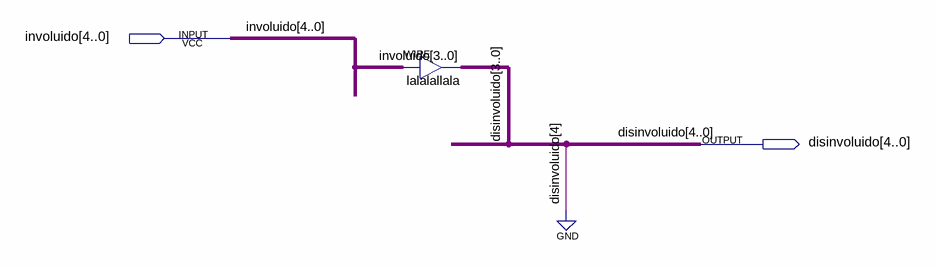
[diagram p0: schematic sheet]
// Quartus schematic apaga_5bit.bdf as structural Verilog: 1 symbols, 2 pins
module apaga_5bit (
  input  [4:0] involuido,
  output [4:0] disinvoluido
);

  assign disinvoluido[3:0] = involuido[3:0];  // WIRE lalalallala

  assign disinvoluido[4] = 1'b0;
endmodule
